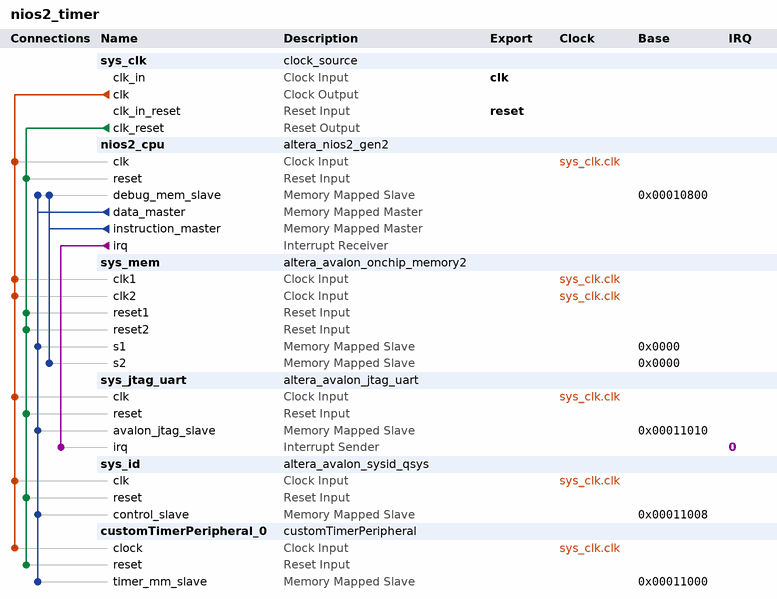
[diagram p0: system contents]
# Platform Designer (Qsys) system nios2_timer, MAX 10 10M08DAF484C8G
# Parameters at their usual value, and those the tool derives, are not listed.
package require -exact qsys 18.1
create_system nios2_timer
set_project_property DEVICE_FAMILY {MAX 10}
set_project_property DEVICE 10M08DAF484C8G

add_instance sys_clk clock_source 18.1
set_instance_parameter_value sys_clk clockFrequency 50000000

add_instance nios2_cpu altera_nios2_gen2 18.1
set_instance_parameter_value nios2_cpu dcache_size 2048
set_instance_parameter_value nios2_cpu exceptionSlave sys_mem.s2
set_instance_parameter_value nios2_cpu icache_size 4096
set_instance_parameter_value nios2_cpu impl Fast
set_instance_parameter_value nios2_cpu resetSlave sys_mem.s2

add_instance sys_mem altera_avalon_onchip_memory2 18.1
set_instance_parameter_value sys_mem dataWidth 32
set_instance_parameter_value sys_mem dualPort true
set_instance_parameter_value sys_mem initMemContent false
set_instance_parameter_value sys_mem initializationFileName onchip_mem.hex
set_instance_parameter_value sys_mem memorySize 40000

add_instance sys_jtag_uart altera_avalon_jtag_uart 18.1
set_instance_parameter_value sys_jtag_uart simInteractiveOptions NO_INTERACTIVE_WINDOWS

add_instance sys_id altera_avalon_sysid_qsys 18.1
set_instance_parameter_value sys_id id 305419896

add_instance customTimerPeripheral_0 customTimerPeripheral 1.0

# connections
add_connection sys_clk.clk customTimerPeripheral_0.clock clock
add_connection sys_clk.clk nios2_cpu.clk clock
add_connection sys_clk.clk sys_id.clk clock
add_connection sys_clk.clk sys_jtag_uart.clk clock
add_connection sys_clk.clk sys_mem.clk1 clock
add_connection sys_clk.clk sys_mem.clk2 clock
add_connection sys_clk.clk_reset customTimerPeripheral_0.reset reset
add_connection sys_clk.clk_reset nios2_cpu.reset reset
add_connection sys_clk.clk_reset sys_id.reset reset
add_connection sys_clk.clk_reset sys_jtag_uart.reset reset
add_connection sys_clk.clk_reset sys_mem.reset1 reset
add_connection sys_clk.clk_reset sys_mem.reset2 reset
add_connection nios2_cpu.data_master customTimerPeripheral_0.timer_mm_slave avalon
set_connection_parameter_value nios2_cpu.data_master/customTimerPeripheral_0.timer_mm_slave baseAddress 0x00011000
add_connection nios2_cpu.data_master nios2_cpu.debug_mem_slave avalon
set_connection_parameter_value nios2_cpu.data_master/nios2_cpu.debug_mem_slave baseAddress 0x00010800
add_connection nios2_cpu.data_master sys_id.control_slave avalon
set_connection_parameter_value nios2_cpu.data_master/sys_id.control_slave baseAddress 0x00011008
add_connection nios2_cpu.data_master sys_jtag_uart.avalon_jtag_slave avalon
set_connection_parameter_value nios2_cpu.data_master/sys_jtag_uart.avalon_jtag_slave baseAddress 0x00011010
add_connection nios2_cpu.data_master sys_mem.s1 avalon
set_connection_parameter_value nios2_cpu.data_master/sys_mem.s1 baseAddress 0x0000
add_connection nios2_cpu.instruction_master nios2_cpu.debug_mem_slave avalon
set_connection_parameter_value nios2_cpu.instruction_master/nios2_cpu.debug_mem_slave baseAddress 0x00010800
add_connection nios2_cpu.instruction_master sys_mem.s2 avalon
set_connection_parameter_value nios2_cpu.instruction_master/sys_mem.s2 baseAddress 0x0000
add_connection nios2_cpu.irq sys_jtag_uart.irq interrupt
set_connection_parameter_value nios2_cpu.irq/sys_jtag_uart.irq irqNumber 0

# exported interfaces
add_interface clk clock sink
set_interface_property clk EXPORT_OF sys_clk.clk_in
add_interface reset reset sink
set_interface_property reset EXPORT_OF sys_clk.clk_in_reset

set_interconnect_requirement {$system} qsys_mm.clockCrossingAdapter HANDSHAKE
set_interconnect_requirement {$system} qsys_mm.enableEccProtection FALSE
set_interconnect_requirement {$system} qsys_mm.insertDefaultSlave FALSE
set_interconnect_requirement {$system} qsys_mm.maxAdditionalLatency 1

save_system nios2_timer.qsys
